# Altium project Universal JTAG Interface.PrjPcb
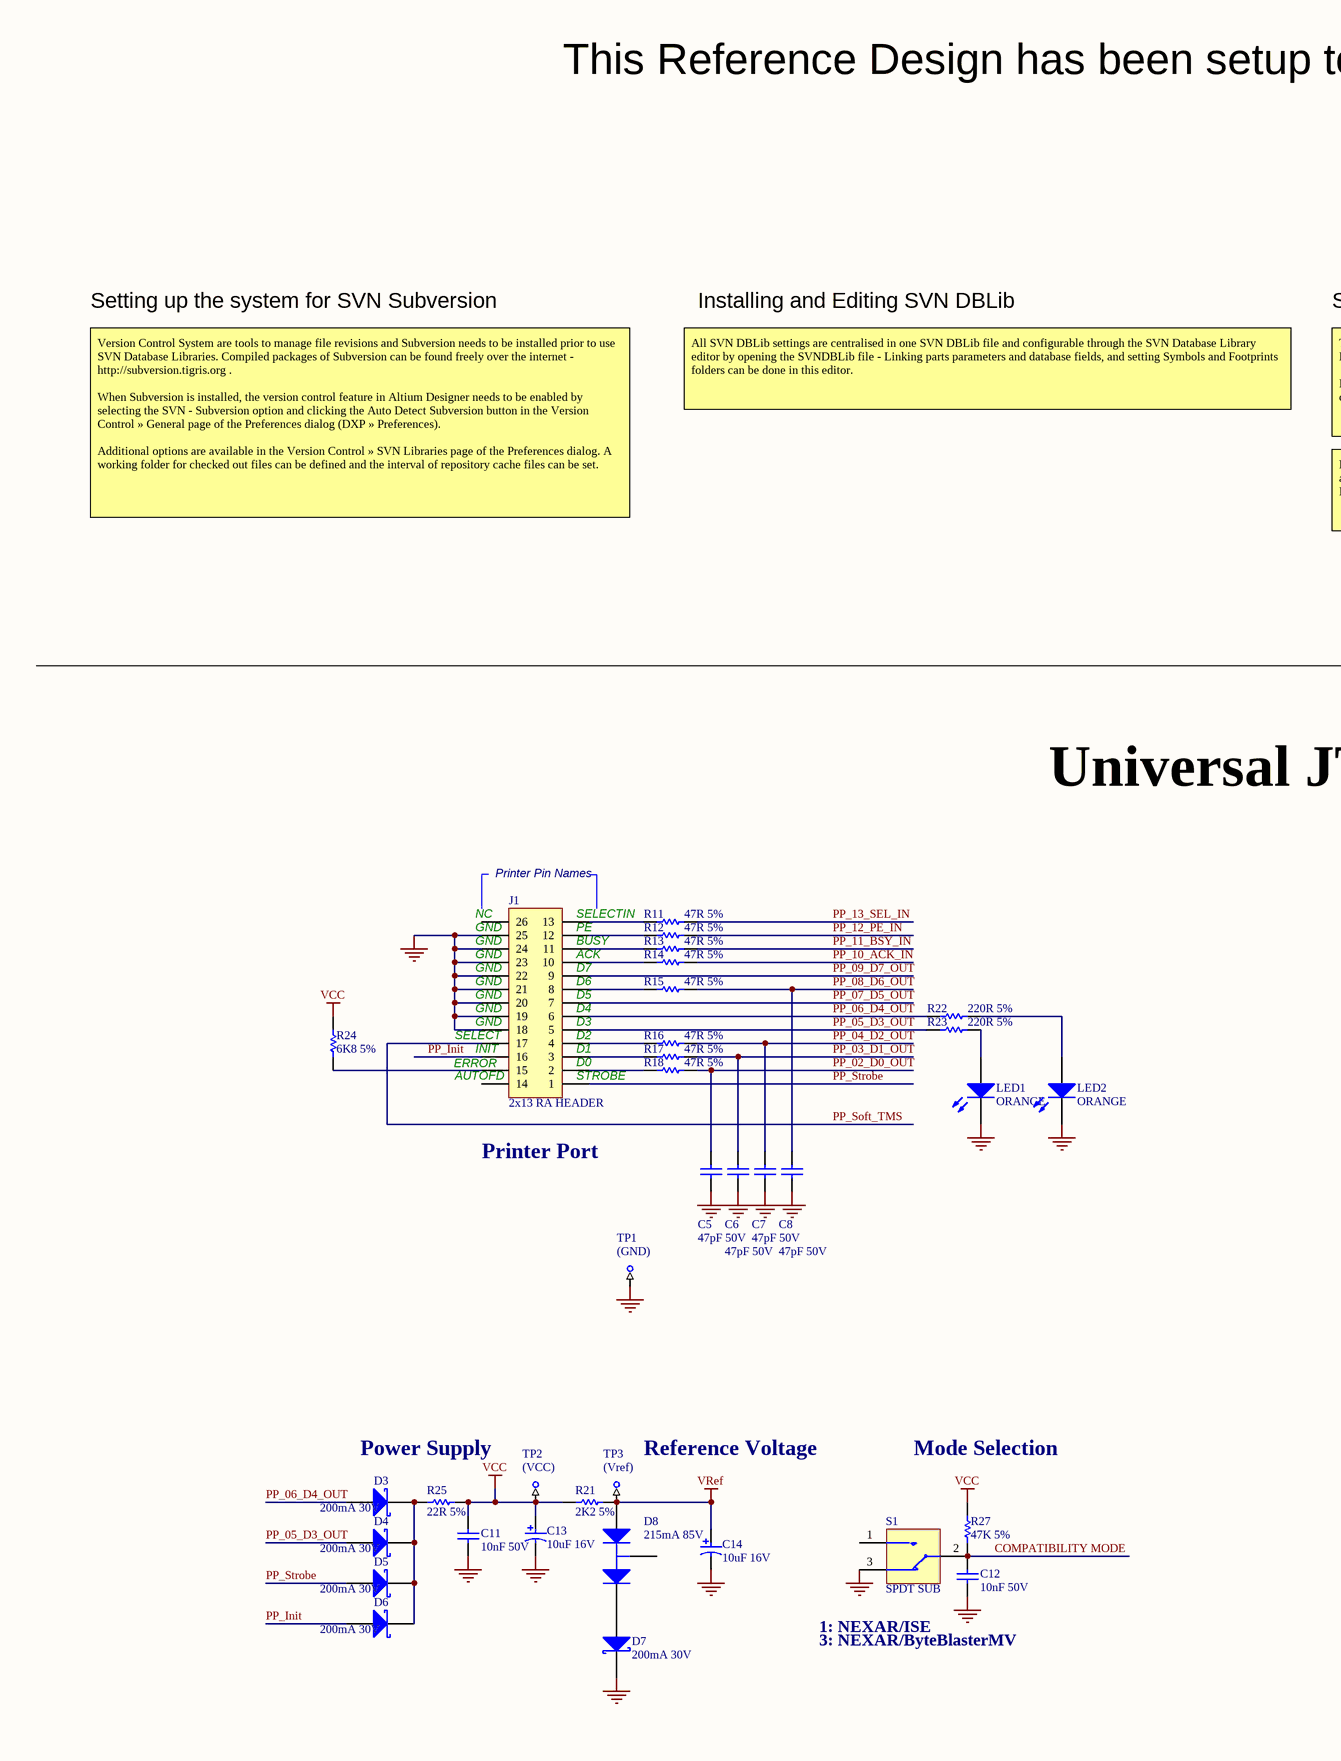
[diagram p0: Universal JTAG Interface.SchDoc, left]
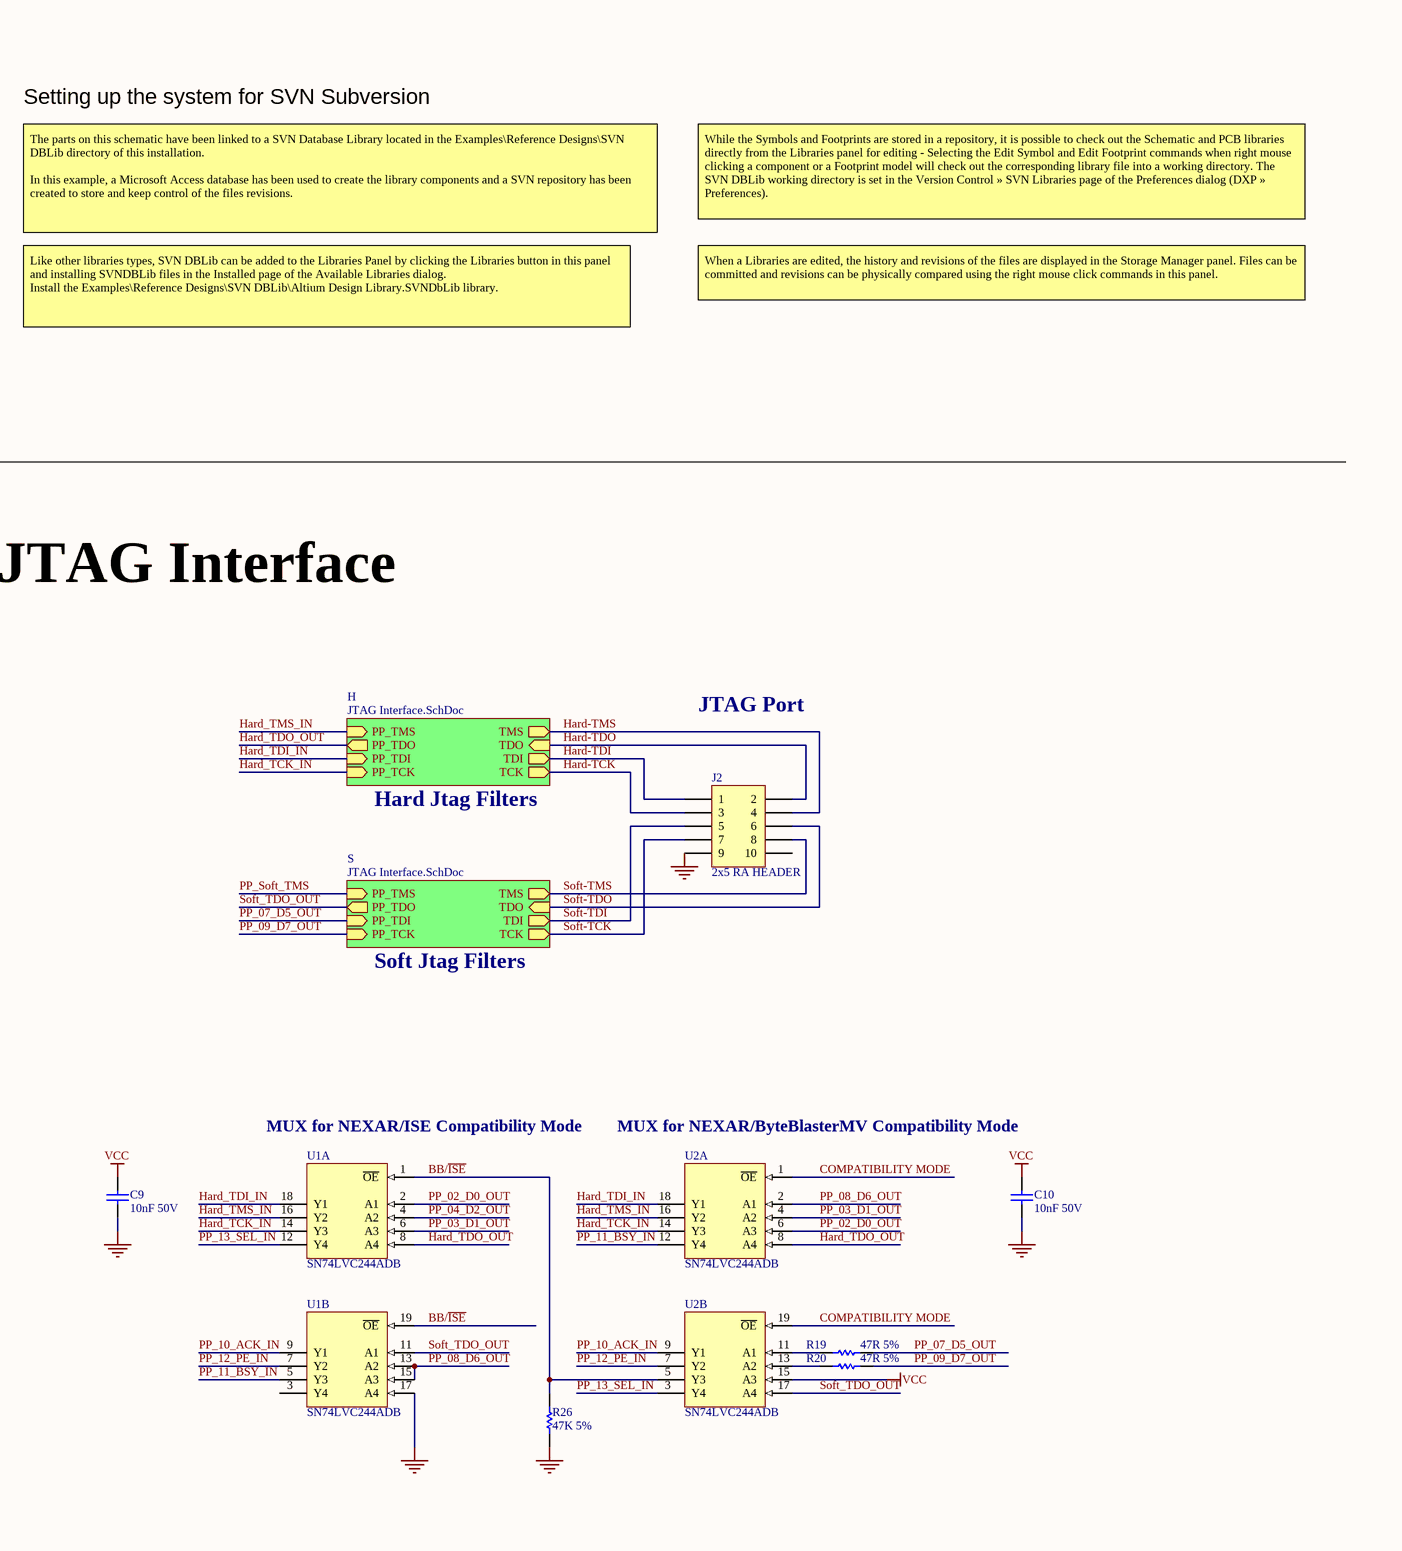
[diagram p1: Universal JTAG Interface.SchDoc, right]
2 sheets, 79 parts. Net scope: hierarchical (ports join the sheet entries above them; power ports are global).
Board file: Universal JTAG Interface.PcbDoc
Sheets:
  Universal JTAG Interface.SchDoc
    H = JTAG Interface.SchDoc
    S = JTAG Interface.SchDoc

## Sheet Universal JTAG Interface.SchDoc: Universal JTAG Interface Rev 1.11
size C; Organization: Altium Limited; Address1: L3, 12a Rodborough Rd; Address2: Frenchs Forest; Address3: NSW; Address4: Australia 2086; DocumentNumber: 1; Revision: 1.11; SheetNumber: 1; SheetTotal: 2

### Parts
C5  47pF 50V  [CAPC2012]
C6  47pF 50V  [CAPC2012]
C7  47pF 50V  [CAPC2012]
C8  47pF 50V  [CAPC2012]
C9  10nF 50V  [CAPC2012]
C10  10nF 50V  [CAPC2012]
C11  10nF 50V  [CAPC2012]
C12  10nF 50V  [CAPC2012]
C13  10uF 16V  [CAPC3528]
C14  10uF 16V  [CAPC3528]
D3  200mA 30V  [SOT95P230-3]
D4  200mA 30V  [SOT95P230-3]
D5  200mA 30V  [SOT95P230-3]
D6  200mA 30V  [SOT95P230-3]
D7  200mA 30V  [SOT95P230-3]
D8  215mA 85V  [SOT95P230-3]
J1  2x13 RA HEADER  [HDR2X13_RA_CENTRONICS]
J2  2x5 RA HEADER  [918510x323]
LED1  ORANGE  [LED3528]
LED2  ORANGE  [LED3528]
R11  47R 5%  [RESC2012]
R12  47R 5%  [RESC2012]
R13  47R 5%  [RESC2012]
R14  47R 5%  [RESC2012]
R15  47R 5%  [RESC2012]
R16  47R 5%  [RESC2012]
R17  47R 5%  [RESC2012]
R18  47R 5%  [RESC2012]
R19  47R 5%  [RESC2012]
R20  47R 5%  [RESC2012]
R21  2K2 5%  [RESC2012]
R22  220R 5%  [RESC2012]
R23  220R 5%  [RESC2012]
R24  6K8 5%  [RESC2012]
R25  22R 5%  [RESC2012]
R26  47K 5%  [RESC2012]
R27  47K 5%  [RESC2012]
S1  SPDT SUB  [OS102011MA1QN1]
TP1  (GND)  [TestPin]  (no BOM)
TP2  (VCC)  [TestPin]  (no BOM)
TP3  (Vref)  [TestPin]  (no BOM)
U1  SN74LVC244ADB  [SOP65P780-20]  (parts A,B of 2)
U2  SN74LVC244ADB  [SOP65P780-20]  (parts A,B of 2)

### Sub-sheets
H = JTAG Interface.SchDoc: TDO (in), TDI (out), TCK (out), TMS (out), PP_TDO (out), PP_TDI (in), PP_TCK (in), PP_TMS (in)
S = JTAG Interface.SchDoc: TDO (in), TDI (out), TCK (out), TMS (out), PP_TDO (out), PP_TDI (in), PP_TCK (in), PP_TMS (in)

### Nets
GND: C5.2 C6.2 C7.2 C8.2 C9.1 C10.1 C11.1 C12.1 C13.2 C14.2 D7.3(k) J1.18 J1.19 J1.20 J1.21 J1.22 J1.23 J1.24 J1.25 J2.9 LED1.2(K) LED2.2(K) R26.2 S1.3 S1.M1 S1.M2 TP1.1 U1.10(GND) U1.17(A4) U2.10(GND)
VCC: C9.2 C10.2 C11.2 C13.1 R21.2 R24.1 R25.1 R27.1 TP2.1 U1.20(VCC) U2.15(A3) U2.20(VCC)
VRef: C14.1 D8.1(A) R21.1 TP3.1
BB/~{ISE}: R26.1 U1.1(~{OE}) U1.19(~{OE}) U2.5(Y3)
COMPATIBILITY MODE: C12.2 R27.2 S1.2 U2.1(~{OE}) U2.19(~{OE})
Hard-TCK: J2.3 ; sheet H/TCK
Hard-TDI: J2.1 ; sheet H/TDI
Hard-TDO: J2.2 ; sheet H/TDO
Hard-TMS: J2.4 ; sheet H/TMS
Hard_TCK_IN: U1.14(Y3) U2.14(Y3) ; sheet H/PP_TCK
Hard_TDI_IN: U1.18(Y1) U2.18(Y1) ; sheet H/PP_TDI
Hard_TDO_OUT: U1.8(A4) U2.8(A4) ; sheet H/PP_TDO
Hard_TMS_IN: U1.16(Y2) U2.16(Y2) ; sheet H/PP_TMS
PP_02_D0_OUT: C5.1 R18.1 U1.2(A1) U2.6(A3)
PP_03_D1_OUT: C6.1 R17.1 U1.6(A3) U2.4(A2)
PP_04_D2_OUT: C7.1 R16.1 U1.4(A2)
PP_05_D3_OUT: D4.1(A) J1.5 R23.2
PP_06_D4_OUT: D3.1(A) J1.6 R22.2
PP_07_D5_OUT: J1.7 R19.1 ; sheet S/PP_TDI
PP_08_D6_OUT: C8.1 R15.1 U1.13(A2) U1.15(A3) U2.2(A1)
PP_09_D7_OUT: J1.9 R20.1 ; sheet S/PP_TCK
PP_10_ACK_IN: R14.1 U1.9(Y1) U2.9(Y1)
PP_11_BSY_IN: R13.1 U1.5(Y3) U2.12(Y4)
PP_12_PE_IN: R12.1 U1.7(Y2) U2.7(Y2)
PP_13_SEL_IN: R11.1 U1.12(Y4) U2.3(Y4)
PP_Init: D6.1(A) J1.16
PP_Soft_TMS: J1.17 ; sheet S/PP_TMS
PP_Strobe: D5.1(A) J1.1
Soft-TCK: J2.7 ; sheet S/TCK
Soft-TDI: J2.5 ; sheet S/TDI
Soft-TDO: J2.6 ; sheet S/TDO
Soft-TMS: J2.8 ; sheet S/TMS
Soft_TDO_OUT: U1.11(A1) U2.17(A4) ; sheet S/PP_TDO
NetD3_3: D3.3(k) D4.3(k) D5.3(k) D6.3(k) R25.2
NetD7_1: D7.1(A) D8.2(K)
NetJ1_2: J1.2 R18.2
NetJ1_3: J1.3 R17.2
NetJ1_4: J1.4 R16.2
NetJ1_8: J1.8 R15.2
NetJ1_10: J1.10 R14.2
NetJ1_11: J1.11 R13.2
NetJ1_12: J1.12 R12.2
NetJ1_13: J1.13 R11.2
NetJ1_15: J1.15 R24.2
NetLED1_1: LED1.1(A) R23.1
NetLED2_1: LED2.1(A) R22.1
NetR19_2: R19.2 U2.11(A1)
NetR20_2: R20.2 U2.13(A2)

Not connected (* = marked no-connect by the designer): D3 2; D4 2; D5 2; D6 2; D7 2; D8 3(C); J1 14 26; J2 10; S1 1; U1 3(Y4)

### Notes on the sheet
- This Reference Design has been setup to illustrate the use of SVN DBLib in Altium Designer.
- Setting up the system for SVN Subversion
- Installing and Editing SVN DBLib
- All SVN DBLib settings are centralised in one SVN DBLib file and configurable through the SVN Database Library editor by opening the SVNDBLib file - Linking parts parameters and database fields, and setting Symbols and Footprints folders can be done in this editor.
- The parts on this schematic have been linked to a SVN Database Library located in the Examples\Reference Designs\SVN DBLib directory of this installation.
  In this example, a Microsoft Access database has been used to create the library components and a SVN repository has been created to store and keep control of the files revisions.
- While the Symbols and Footprints are stored in a repository, it is possible to check out the Schematic and PCB libraries directly from the Libraries panel for editing - Selecting the Edit Symbol and Edit Footprint commands when right mouse clicking a component or a Footprint model will check out the corresponding library file into a working directory. The SVN DBLib working directory is set in the Version Control » SVN Libraries page of the Preferences dialog (DXP » Preferences).
- When a Libraries are edited, the history and revisions of the files are displayed in the Storage Manager panel. Files can be committed and revisions can be physically compared using the right mouse click commands in this panel.
- Version Control System are tools to manage file revisions and Subversion needs to be installed prior to use SVN Database Libraries. Compiled packages of Subversion can be found freely over the internet - http://subversion.tigris.org .
  When Subversion is installed, the version control feature in Altium Designer needs to be enabled by selecting the SVN - Subversion option and clicking the Auto Detect Subversion button in the Version Control » General page of the Preferences dialog (DXP » Preferences).
  Additional options are available in the Version Control » SVN Libraries page of the Preferences dialog. A working folder for checked out files can be defined and the interval of repository cache files can be set.
- Like other libraries types, SVN DBLib can be added to the Libraries Panel by clicking the Libraries button in this panel and installing SVNDBLib files in the Installed page of the Available Libraries dialog.
  Install the Examples\Reference Designs\SVN DBLib\Altium Design Library.SVNDbLib library.
- Universal JTAG Interface
- (near J1) Printer Pin Names
- (near J1) GND
- (near J1) NC
- (near J1) SELECTIN
- (near J1) PE
- (near J1) BUSY
- (near J1) ACK
- (near J1) D7
- JTAG Port
- (near J1) SELECT
- (near J1) D2
- (near J1) D3
- (near J1) D4
- (near J1) D5
- (near J1) D6
- Hard Jtag Filters
- (near J1) ERROR
- (near J1) AUTOFD
- (near J1) INIT
- (near J1) STROBE
- (near J1) D0
- (near J1) D1
- Printer Port
- Soft Jtag Filters
- (near U1) MUX for NEXAR/ISE Compatibility Mode
- MUX for NEXAR/ByteBlasterMV Compatibility Mode
- Power Supply
- Reference Voltage
- Mode Selection
- 1: NEXAR/ISE
- 3: NEXAR/ByteBlasterMV
- Title
- Size:
- Date:
- File:
- C
- Number:
- Time:
- Revision:
- Sheet
- of

### Library data of the parts
C5-C12 = CAP-NP: Capacitor
  C5-C8: Design Item Id: CAP-NP-47pF-50V-0805
  C9-C12: Design Item Id: CAP-NP-10nF-50V-0805
C13 C14 = CAP-P: Polar Capacitor; Design Item Id: CAP-P-10uF-16V-MCCT-B
D3-D7 = DIO-SCHOTTKY-1S-SOT23: Schottky Barrier Single Diode; Design Item Id: DIO-SCHOTTKY-1S-SOT23
D8 = DIO-2S: Silicon Switching Diode Array for High-Speed Switching; Design Item Id: DIO-2S-215mA-85V
J1 = CON-IDC-2x13-M-RA: Header, 13-Pin, Dual row; Design Item Id: CON-IDCHDRRA-2x13
J2 = CON-IDC-2x5-M-RA: Header, 5-Pin, Dual row, Right angle boxed; Design Item Id: CON-IDCHDRRA-2x5-2.54mm
LED1 LED2 = DIO-LED-1S: Typical GREEN SMD LED Agilent make; Design Item Id: LED-ORG-TLOU1102
R11-R27 = RES: Resistor
  R11-R20: Design Item Id: RES-47R-0805
  R21: Design Item Id: RES-2K2-0805
  R22 R23: Design Item Id: RES-220R-0805
  R24: Design Item Id: RES-6K8-0805
  R25: Design Item Id: RES-22R-0805
  R26 R27: Design Item Id: RES-47K-0805
S1 = SWI-TOG-SPDT-OS102011MA1QN1: SPDT Subminiature Toggle Switch; Design Item Id: SWI-SPDTSUB-OS102011MA1QN1
TP1-TP3 = TestPin: Design Item Id: TestPin
U1 U2 = SN74LVC244: Octal Buffer/Driver with 3-State Outputs; Design Item Id: SN74LVC244ADB

## Sheet JTAG Interface.SchDoc: Universal JTAG Interface Rev 1.11
size A; Organization: Altium Limited; Address1: L3, 12a Rodborough Rd; Address2: Frenchs Forest; Address3: NSW; Address4: Australia 2086; DocumentNumber: 2; SheetNumber: 2; SheetTotal: 2
Used 2 times, as channels H, S. Parts and nets are listed once, with the designators drawn on the sheet.
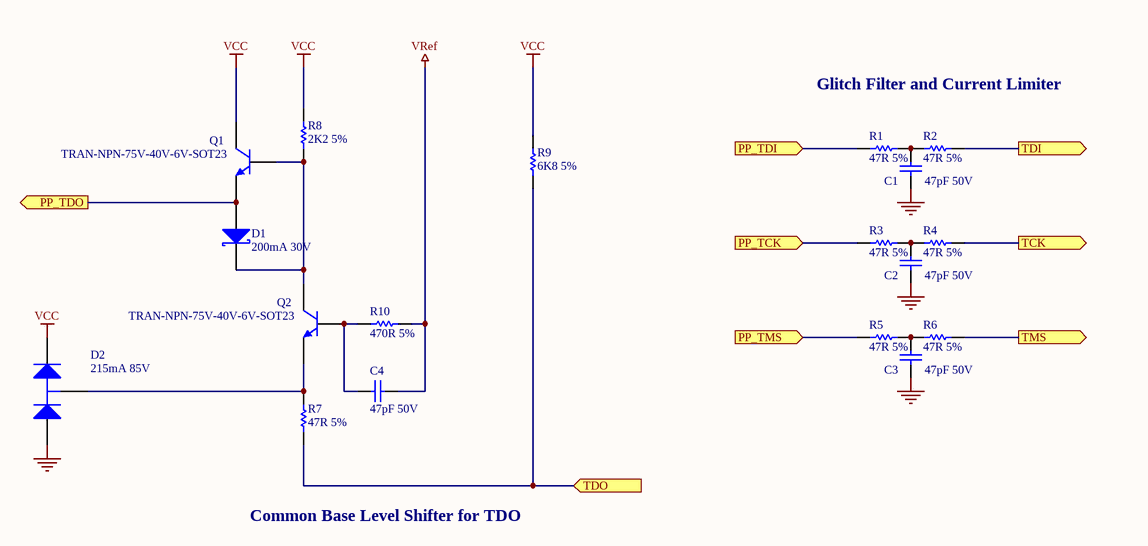
[diagram p2: JTAG Interface.SchDoc]

### Parts
C1  47pF 50V  [CAPC2012]
C2  47pF 50V  [CAPC2012]
C3  47pF 50V  [CAPC2012]
C4  47pF 50V  [CAPC2012]
D1  200mA 30V  [SOT95P230-3]
D2  215mA 85V  [SOT95P230-3]
Q1  TRAN-NPN-75V-40V-6V-SOT23  [SOT95P230-3]
Q2  TRAN-NPN-75V-40V-6V-SOT23  [SOT95P230-3]
R1  47R 5%  [RESC2012]
R2  47R 5%  [RESC2012]
R3  47R 5%  [RESC2012]
R4  47R 5%  [RESC2012]
R5  47R 5%  [RESC2012]
R6  47R 5%  [RESC2012]
R7  47R 5%  [RESC2012]
R8  2K2 5%  [RESC2012]
R9  6K8 5%  [RESC2012]
R10  470R 5%  [RESC2012]

### Ports
PP_TCK (in), PP_TDI (in), PP_TDO (out), PP_TMS (in), TCK (out), TDI (out), TDO (in), TMS (out)

### Nets
GND: C1.2 C2.2 C3.2 D2.1(A)
VCC: D2.2(K) Q1.3(C) R8.2 R9.2
VRef: C4.2 R10.1
PP_TCK: R3.1 ; port PP_TCK
PP_TDI: R1.1 ; port PP_TDI
PP_TDO: D1.1(A) Q1.2(E) ; port PP_TDO
PP_TMS: R5.1 ; port PP_TMS
TCK: R4.2 ; port TCK
TDI: R2.2 ; port TDI
TDO: R7.1 R9.1 ; port TDO
TMS: R6.2 ; port TMS
NetC1_1: C1.1 R1.2 R2.1
NetC2_1: C2.1 R3.2 R4.1
NetC3_1: C3.1 R5.2 R6.1
NetC4_1: C4.1 Q2.1(B) R10.2
NetD1_3: D1.3(k) Q1.1(B) Q2.3(C) R8.1
NetD2_3: D2.3(C) Q2.2(E) R7.2

Not connected (* = marked no-connect by the designer): D1 2

### Channels
H: designators end in H; ports PP_TCK=Hard_TCK_IN PP_TDI=Hard_TDI_IN PP_TDO=Hard_TDO_OUT PP_TMS=Hard_TMS_IN TCK=Hard-TCK TDI=Hard-TDI TDO=Hard-TDO TMS=Hard-TMS
S: designators end in S; ports PP_TCK=PP_09_D7_OUT PP_TDI=PP_07_D5_OUT PP_TDO=Soft_TDO_OUT PP_TMS=PP_Soft_TMS TCK=Soft-TCK TDI=Soft-TDI TDO=Soft-TDO TMS=Soft-TMS

### Notes on the sheet
- Glitch Filter and Current Limiter
- Common Base Level Shifter for TDO
- Title
- Size:
- Date:
- A
- Number:
- Time:
- Revision:
- Sheet
- of
- File:

### Library data of the parts
C1-C4 = CAP-NP: Capacitor; Design Item Id: CAP-NP-47pF-50V-0805
D1 = DIO-SCHOTTKY-1S-SOT23: Schottky Barrier Single Diode; Design Item Id: DIO-SCHOTTKY-1S-SOT23
D2 = DIO-2S: as D8 on sheet Universal JTAG Interface; Design Item Id: DIO-2S-215mA-85V
Q1 Q2 = TRA-NPN: General Purpose Transistor NPN Silicon; Design Item Id: TRAN-NPN-75V-40V-6V-SOT23
R1-R10 = RES: Resistor
  R1-R7: Design Item Id: RES-47R-0805
  R8: Design Item Id: RES-2K2-0805
  R9: Design Item Id: RES-6K8-0805
  R10: Design Item Id: RES-470R-0805

## Nets that join several sheets
GND: Universal JTAG Interface (30 pins), H (C1H.2 C2H.2 C3H.2 D2H.1), S (C1S.2 C2S.2 C3S.2 D2S.1)
VCC: Universal JTAG Interface (12 pins), H (D2H.2 Q1H.3 R8H.2 R9H.2), S (D2S.2 Q1S.3 R8S.2 R9S.2)
VRef: Universal JTAG Interface (C14.1 D8.1 R21.1 TP3.1), H (C4H.2 R10H.1), S (C4S.2 R10S.1)
Hard-TCK: Universal JTAG Interface (J2.3), H (R4H.2)
Hard-TDI: Universal JTAG Interface (J2.1), H (R2H.2)
Hard-TDO: Universal JTAG Interface (J2.2), H (R7H.1 R9H.1)
Hard-TMS: Universal JTAG Interface (J2.4), H (R6H.2)
Hard_TCK_IN: Universal JTAG Interface (U1.14 U2.14), H (R3H.1)
Hard_TDI_IN: Universal JTAG Interface (U1.18 U2.18), H (R1H.1)
Hard_TDO_OUT: Universal JTAG Interface (U1.8 U2.8), H (D1H.1 Q1H.2)
Hard_TMS_IN: Universal JTAG Interface (U1.16 U2.16), H (R5H.1)
PP_07_D5_OUT: Universal JTAG Interface (J1.7 R19.1), S (R1S.1)
PP_09_D7_OUT: Universal JTAG Interface (J1.9 R20.1), S (R3S.1)
PP_Soft_TMS: Universal JTAG Interface (J1.17), S (R5S.1)
Soft-TCK: Universal JTAG Interface (J2.7), S (R4S.2)
Soft-TDI: Universal JTAG Interface (J2.5), S (R2S.2)
Soft-TDO: Universal JTAG Interface (J2.6), S (R7S.1 R9S.1)
Soft-TMS: Universal JTAG Interface (J2.8), S (R6S.2)
Soft_TDO_OUT: Universal JTAG Interface (U1.11 U2.17), S (D1S.1 Q1S.2)